# EasyEDA Pro project 阿伟1号.eprj

# Schematic Schematic1
Create Date: 2023-02-14; Page Name: P1; Project Name: New Project_2023-02-14_20-02-58; Schematic Name: Schematic1; Update Date: 2023-02-14; Company: 嘉立创EDA; Page Size: A4; Version: V1.0
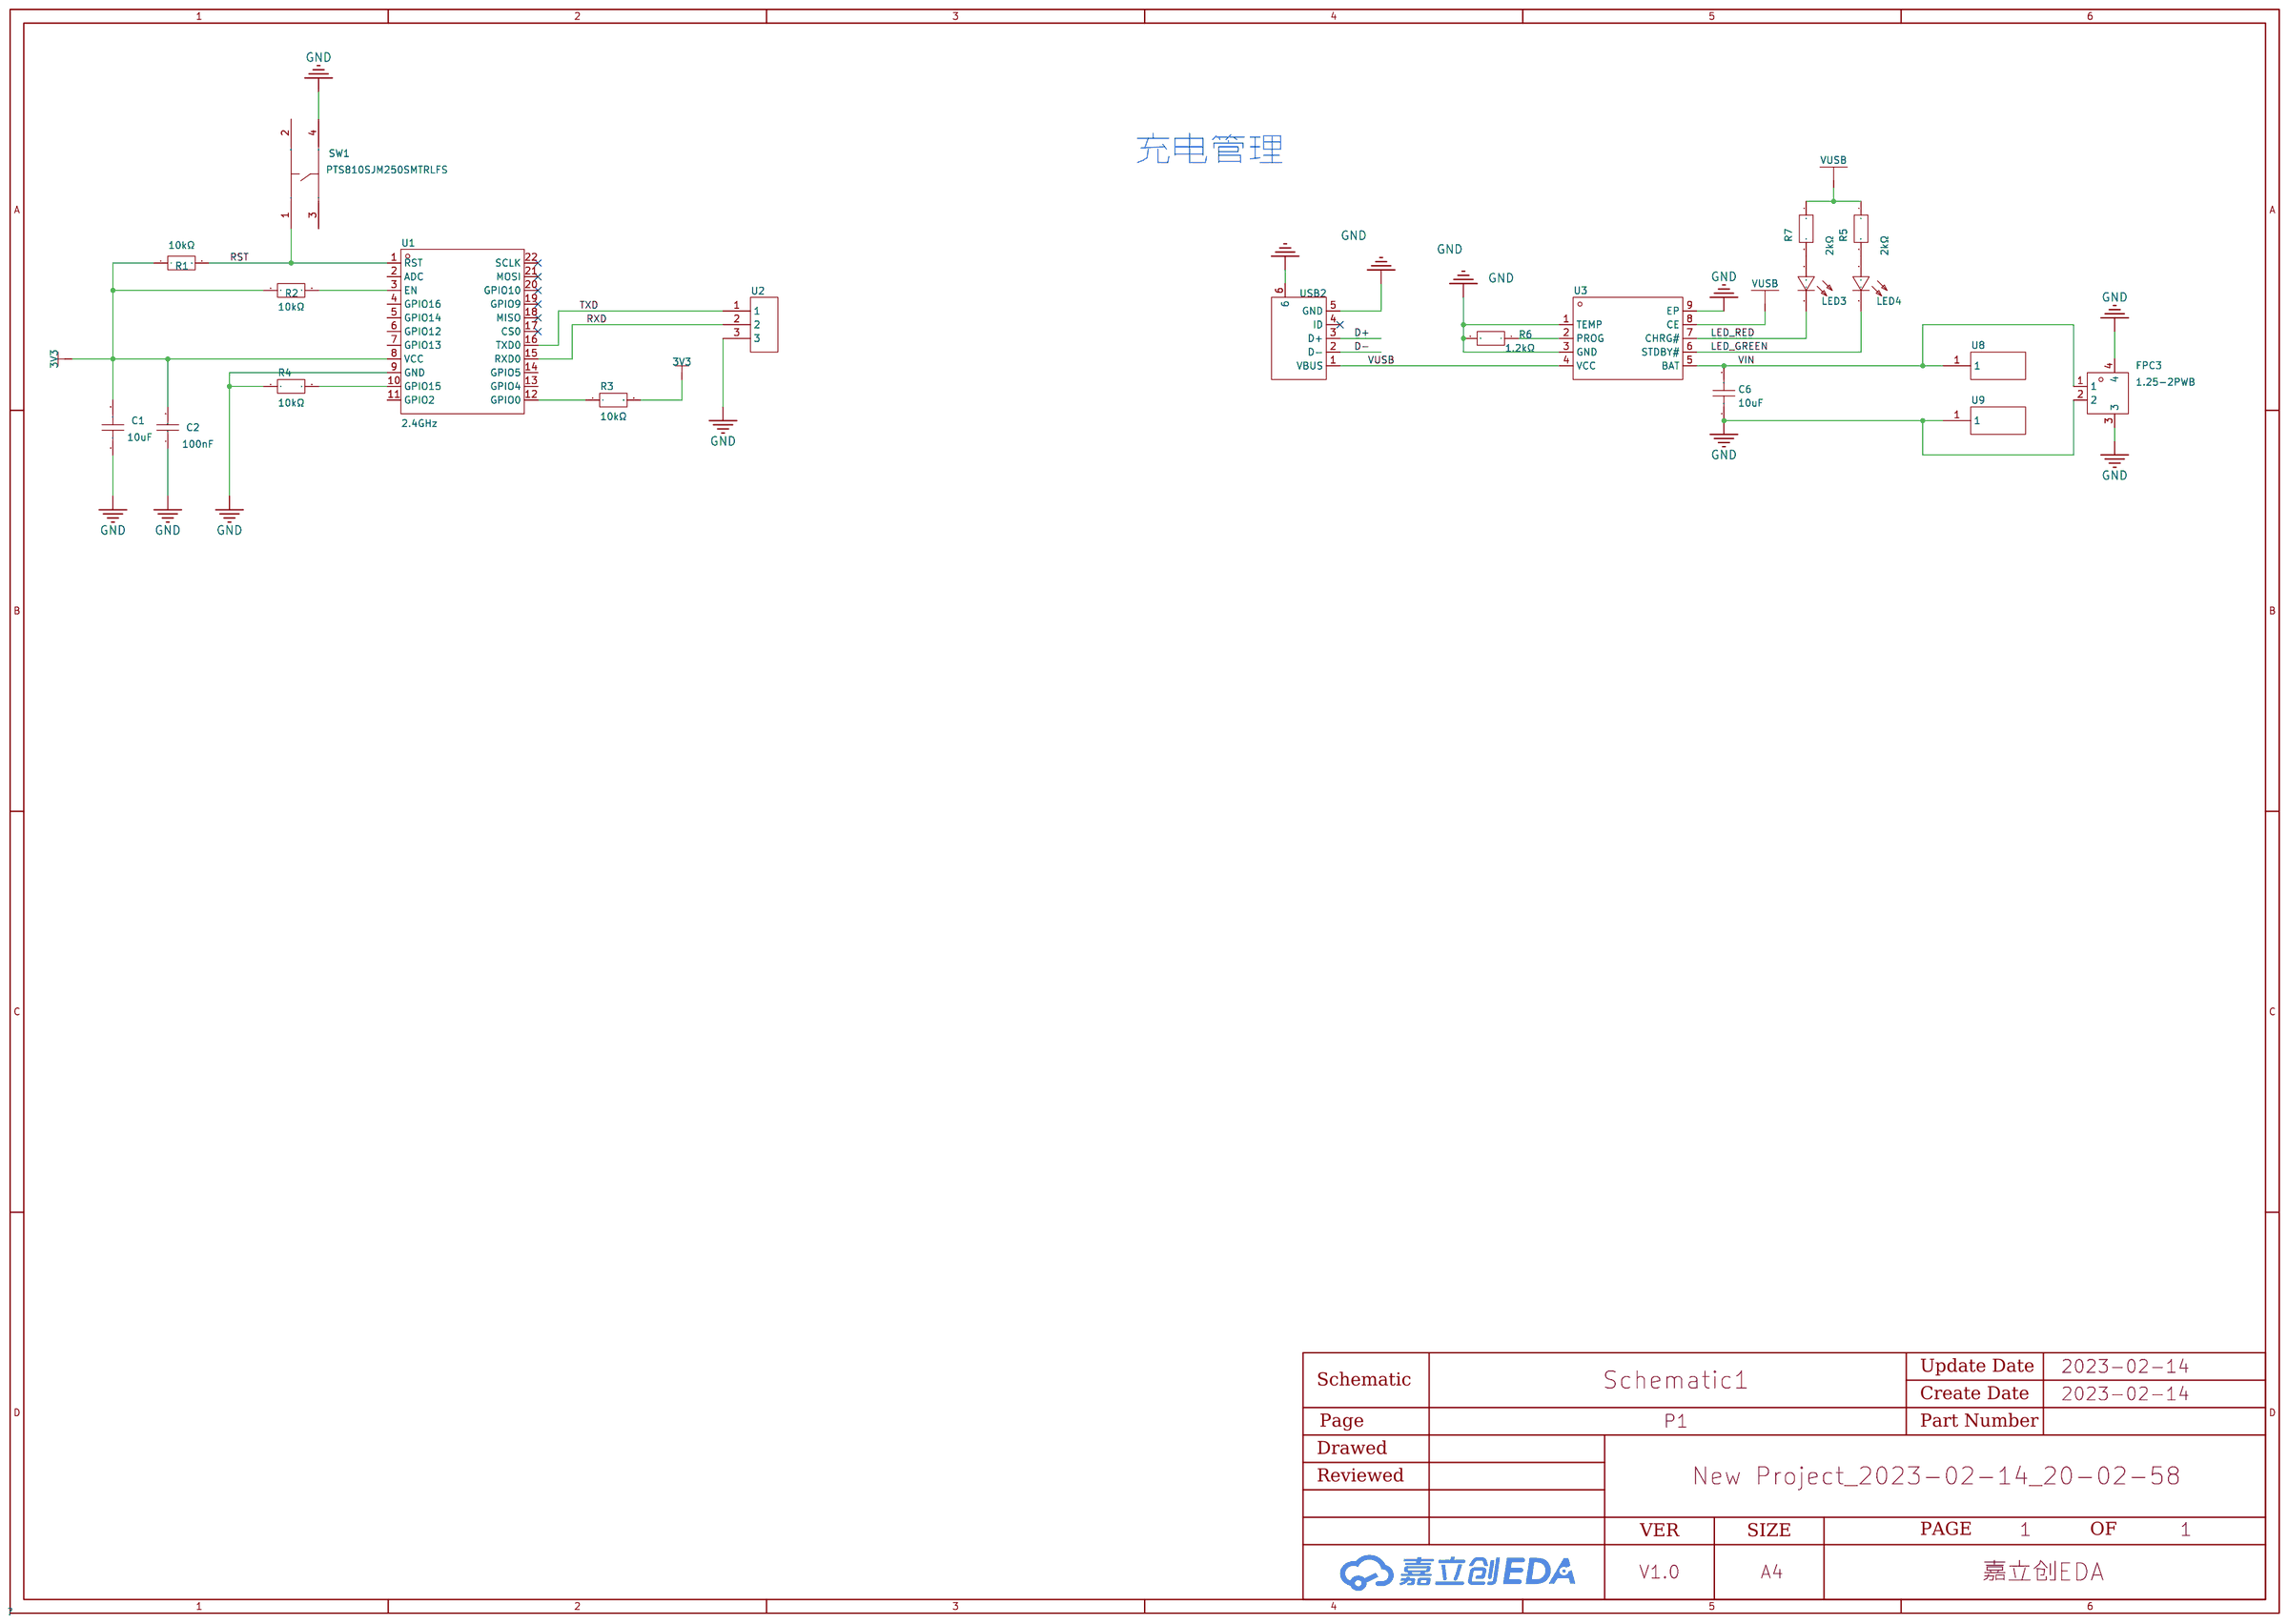
[diagram p0: schematic sheet]

## Parts
C1  10uF  [C0805]
C2  100nF  [C0805]
C6  10uF  [C0603]
FPC3  1.25-2PWB  [CONN-SMD_2P-P1.25_DEALON_1.25-2PWB]
LED3  -  [led0603-fd]
LED4  -  [led0603-fd]
R1  10kΩ  [R0805]
R2  10kΩ  [R0805]
R3  10kΩ  [R0805]
R4  10kΩ  [R0805]
R5  2kΩ  [r0603]
R6  1.2kΩ  [r0603]
R7  2kΩ  [r0603]
SW1  PTS810SJM250SMTRLFS  [KEY-SMD_4P-L4.2-W3.2-P2.20-LS4.6]
U1  2.4GHz  [WIFIM-SMD_ESP-12F-ESP8266MOD]
U2  -
U3  -  [ESOP-8_L4.9-W3.9-P1.27-LS6.0-BL-EP]
U8  -  [电池焊接端子封装2]
U9  -  [电池焊接端子封装2]
USB2  -  [micro-usb-smd_u254-051n-4bh24-s2]

## Library data of the parts
C1 = CL21A106KBYQNNE: 容值:10uF;精度:±10%;额定电压:50V;材质(温度系数):X5R;; LCSC Part Name: 10uF ±10% 50V; Supplier Part: C2932476; Manufacturer: SAMSUNG(三星); Supplier Footprint: 0805; JLCPCB Part Class: 扩展库; Datasheet: https://atta.szlcsc.com/upload/public/pdf/source/20211217/EA547804C3DC63CB0E92325AB8B6CF61.pdf; Supplier: LCSC; Tolerance: ±10%; Voltage Rated: 50V; Temperature Coefficient: X5R
C2 = CL21B104KBCNNNC: 容值:100nF;精度:±10%;额定电压:50V;材质(温度系数):X7R;; LCSC Part Name: 100nF ±10% 50V; Supplier Part: C1711; Manufacturer: SAMSUNG(三星); Supplier Footprint: 0805; JLCPCB Part Class: 扩展库; Datasheet: https://atta.szlcsc.com/upload/public/pdf/source/20160103/1457707693305.pdf; Supplier: LCSC; Tolerance: ±10%; Voltage Rated: 50V; Temperature Coefficient: X7R
C6 = CL10A106MA8NRNC: 容值:10uF;精度:±20%;额定电压:25V;材质(温度系数):X5R;; LCSC Part Name: 10uF ±20% 25V; Supplier Part: C96446; Manufacturer: SAMSUNG(三星); Supplier Footprint: 0603; JLCPCB Part Class: 基础库; Datasheet: https://atta.szlcsc.com/upload/public/pdf/source/20170325/1490427913016.pdf; Supplier: LCSC; Tolerance: ±20%; Voltage Rated: 25V; Temperature Coefficient: X5R
FPC3 = 1.25-2PWB: 参考系列:-;间距:1.25mm;插针结构:1x2P;排数:1;每排PIN数:2;行距:-;公母:公型插针;安装方式:卧贴;额定电流:-;工作温度范围:-40~+85;; LCSC Part Name: 1.25mm 1x2P 卧贴; Supplier Part: C2905009; Manufacturer: DEALON(德艺隆); Supplier Footprint: SMD,P=1.25mm; JLCPCB Part Class: 扩展库; Datasheet: https://atta.szlcsc.com/upload/public/pdf/source/20211025/32B11FCE5054D08D2841E43E3DE676AA.pdf; Supplier: LCSC; Pitch: 1.25mm; Pins Structure: 1x2P; Number of Rows: 1; Number of PINs Per Row: 2; Gender: 公型插针; Mounting Style: 卧贴; Operating Temperature Range: -40~+85
LED3 LED4 = ncd0603r1: 发光颜色:红灯;; LCSC Part Name: 红灯; Supplier Part: C84263; Manufacturer: 国星光电; Manufacturer Part: NCD0603R1; Supplier Footprint: 0603; JLCPCB Part Class: Extended Part; Datasheet: https://atta.szlcsc.com/upload/public/pdf/source/20200820/C84263_DABC6A75E58F576973B407FDBA283D60.pdf; Supplier: LCSC; Emitted Color: 红灯
R1-R4 = ERA6ARB103V: 电阻类型:薄膜电阻;阻值:10kΩ;精度:±0.1%;功率:125mW;温度系数:±10ppm/℃;最大工作电压:100V;工作温度范围:-55℃~+155℃;; LCSC Part Name: 10kΩ ±0.1% 125mW; Supplier Part: C509088; Manufacturer: PANASONIC(松下); Supplier Footprint: 0805; JLCPCB Part Class: 扩展库; Datasheet: https://atta.szlcsc.com/upload/public/pdf/source/20200407/C509088_ECD296D7C56176909E25C3E564395375.pdf; Supplier: LCSC; Type: 薄膜电阻; Tolerance: ±0.1%; Power(Watts): 125mW; Temperature Coefficient: ±10ppm/℃; Overload Voltage (Max): 100V; Operating Temperature Range: -55℃~+155℃
R5 R7 = sg73p1jttd1002f: 阻值:2kΩ;精度:±1%;功率:-;温度系数:-;; LCSC Part Name: 2kΩ ±1%; Supplier Part: C22975; Manufacturer: KOA; Manufacturer Part: SG73P1JTTD1002F; Supplier Footprint: 0603; JLCPCB Part Class: Extended Part; Datasheet: https://atta.szlcsc.com/upload/public/pdf/source/20190109/C346159_A2BB9C83E7E727C8F8277542505B206B.pdf; Supplier: LCSC; Tolerance: ±1%
R6 = sg73p1jttd1002f: 阻值:10kΩ;精度:±1%;功率:-;温度系数:-;; LCSC Part Name: 1.2kΩ ±1%; Supplier Part: C22765; Manufacturer: KOA; Manufacturer Part: SG73P1JTTD1002F; Supplier Footprint: 0603; JLCPCB Part Class: Extended Part; Datasheet: https://atta.szlcsc.com/upload/public/pdf/source/20190109/C346159_A2BB9C83E7E727C8F8277542505B206B.pdf; Supplier: LCSC; Tolerance: ±1%
SW1 = PTS810SJM250SMTRLFS: 触点电流:50mA;额定电压(DC):16V;电路结构:单刀单掷;按钮作用方向:顶部触动;致动器样式:圆形按钮;照明颜色:-;开关长度:4.2mm;开关宽度:3.2mm;开关高度:2.5mm;; Supplier Part: C116501; Manufacturer: C&K; Supplier Footprint: SMD; JLCPCB Part Class: 扩展库; Datasheet: https://atta.szlcsc.com/upload/public/pdf/source/20180704/C116501_199B7AD0EF93D1F69D47FA53D559C299.pdf; Supplier: LCSC; Contact Current: 50mA; Voltage Rating (DC): 16V; Circuit: 单刀单掷; Actuator Orientation: 顶部触动; Actuator Style: 圆形按钮; Switch Length: 4.2mm; Switch Width: 3.2mm; Switch Height: 2.5mm
U1 = ESP-12F(ESP8266MOD): 频率:2.4GHz;发射功率:16dBm;核心处理器:ESP8266;天线形式:PCB 板载天线;接收灵敏度:-90dBm;; Supplier Part: C82891; Manufacturer: Ai-Thinker(安信可); Supplier Footprint: WIFI Module; JLCPCB Part Class: 扩展库; Datasheet: https://atta.szlcsc.com/upload/public/pdf/source/20210219/C82891_ABD84A460F4F056A2757267CCCA4B508.pdf; Supplier: LCSC; Output Power: 16dBm; Core Processor: ESP8266; Support Interface: GPIO；UART；IIC；PWM；SPI；ADC; Antenna Type: PCB 板载天线; Wireless Standard: 802.11b/g/n; Operating Voltage: 3.3V; Receive  Current: 120mA; Send  Current: 170mA; Sensitivity: -90dBm; Operating Temperature: -40℃~+85℃
U2 = 下载调试点
U3 = TP4056: 充电电池的类型:-;电池单元组数:-;最大充电电流:-;充满的电池组电压:-;最大供应电压:-;; Supplier Part: C725790; Manufacturer: UMW(友台半导体); Supplier Footprint: ESOP-8; JLCPCB Part Class: Extended Part; Datasheet: https://atta.szlcsc.com/upload/public/pdf/source/20211011/37515E71BA298E23D23475482C49633D.pdf; Supplier: LCSC
U8 U9 = 电池焊接端子2
USB2 = u254-051n-4bh24-s2s: 连接器类型:Micro-B;标准:USB 2.0;公母:母座;触点数量:5;端口数量:1;安装方式:卧贴;额定电流 - 电源:-;工作温度范围:-40~+85;; LCSC Part Name: Micro-B 母座 卧贴 牛角5.2; Supplier Part: C692421; Manufacturer: XKB Connectivity(中国星坤); Manufacturer Part: U254-051N-4BH24-S2S; Supplier Footprint: SMD; JLCPCB Part Class: Extended Part; Datasheet: https://atta.szlcsc.com/upload/public/pdf/source/20211011/B206D16459F712703796869A87C6FBF1.pdf; Supplier: LCSC; Connector Type: Micro-B; Standard: USB 2.0; Gender: 母座; Number of Contacts: 5; Number of Ports: 1; Mounting Style: 卧贴; Operating Temperature Range: -40~+85

## Nets
3V3: C1.2 C2.2 R1.1 R2.1 R3.2 U1.8(VCC)
GND: C1.1 C2.1 C6.1 FPC3.2 FPC3.3 FPC3.4 R4.1 R6.2 SW1.4 U1.9(GND) U2.3 U3.1(TEMP) U3.3(GND) U3.9(EP) U9.1 USB2.5(GND) USB2.6
VIN: C6.2 FPC3.1 U3.5(BAT) U8.1
D+: USB2.3(D+)
D-: USB2.2(D-)
LED_GREEN: LED4.2(K) U3.6(STDBY#)
LED_RED: LED3.2(K) U3.7(CHRG#)
RST: R1.2 SW1.1 U1.1(RST)
RXD: U1.15(RXD0) U2.2
TXD: U1.16(TXD0) U2.1
VUSB: R5.1 R7.1 U3.4(VCC) U3.8(CE) USB2.1(VBUS)
Net-(LED3-1): LED3.1(A) R7.2
Net-(LED4-1): LED4.1(A) R5.2
Net-(R2-2): R2.2 U1.3(EN)
Net-(R3-1): R3.1 U1.12(GPIO0)
Net-(R4-2): R4.2 U1.10(GPIO15)
Net-(R6-1): R6.1 U3.2(PROG)

Not connected (* = marked no-connect by the designer): SW1 2 3; U1 2(ADC) 4(GPIO16) 5(GPIO14) 6(GPIO12) 7(GPIO13) 11(GPIO2) 13(GPIO4) 14(GPIO5) 17(CS0)* 18(MISO)* 19(GPIO9)* 20(GPIO10)* 21(MOSI)* 22(SCLK)*; USB2 4(ID)*

## Notes on the sheet
- 充电管理
